# EAGLE design MAX3378 Regulado-v10 (EAGLE 6.2)
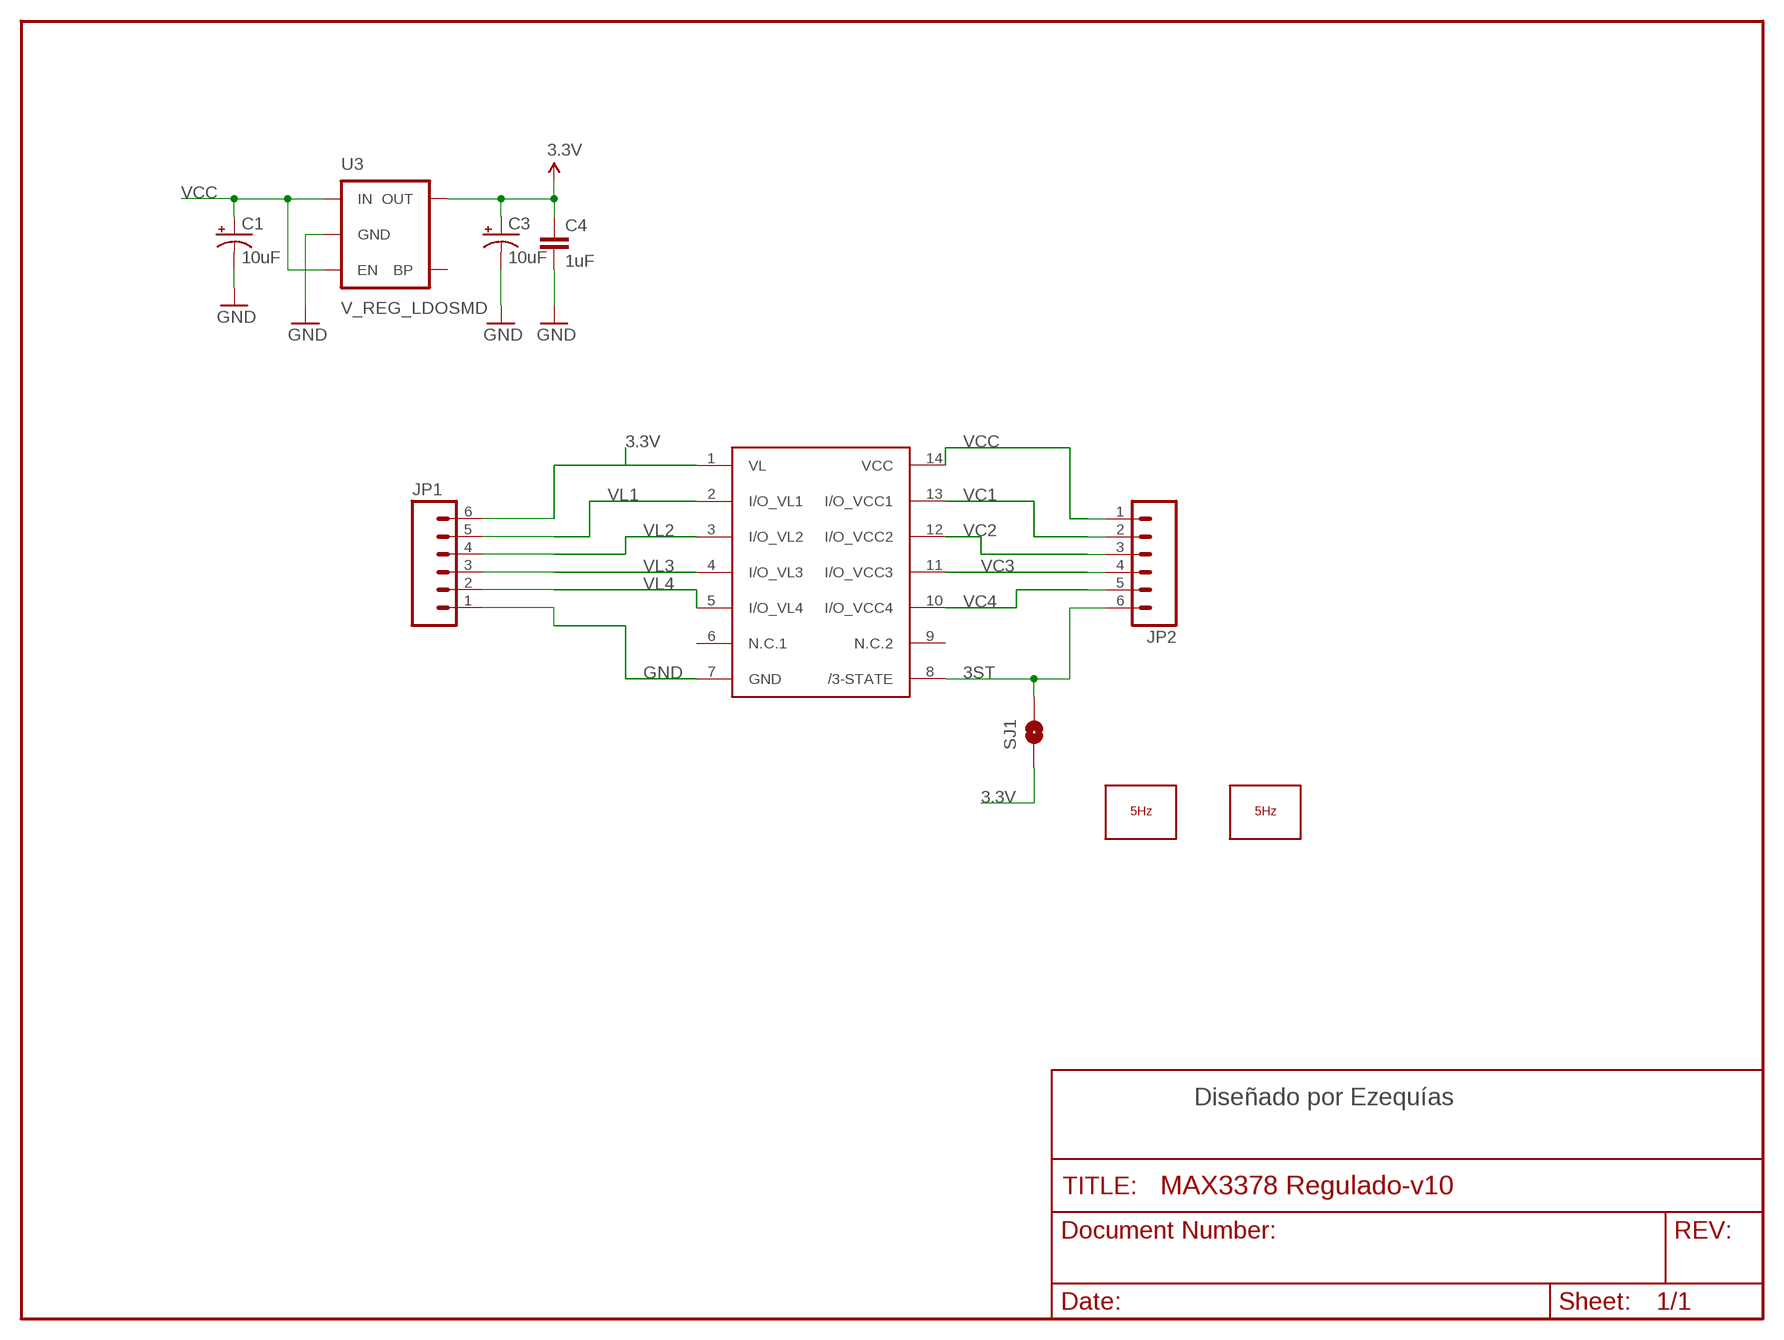
[diagram p0: schematic, sheet 1]

## Parts
C1  10uF  CAP_POL1206  [EIA3216]
C3  10uF  CAP_POL1206  [EIA3216]
C4  1uF  CAP0603-CAP  [0603-CAP]
JP1  M06SIP  [1X06]
JP2  M06SIP  [1X06]
LOGO1  LOGO_5HZ_H_COOPER_15MM  [5HZ_LOGO_H_COOPER_15MM]
LOGO2  LOGO_5HZ_WEB_10MM  [5HZ_WEB_10MM]
SJ1  SOLDERJUMPERNO  [SJ_2S-NO]
U3  V_REG_LDOSMD  [SOT23-5]
U$1  MAX3378  [TSSOP14]

## Nets
3.3V: C3.A(+) C4.1 JP1.6 SJ1.1 U3.5(OUT) U$1.1(VL)
3ST: JP2.6 SJ1.2 U$1.8(/3-STATE)
GND: C1.C(-) C3.C(-) C4.2 JP1.1 U3.2(GND) U$1.7(GND)
VC1: JP2.2 U$1.13(I/O_VCC1)
VC2: JP2.3 U$1.12(I/O_VCC2)
VC3: JP2.4 U$1.11(I/O_VCC3)
VC4: JP2.5 U$1.10(I/O_VCC4)
VCC: C1.A(+) JP2.1 U3.1(IN) U3.3(EN) U$1.14(VCC)
VL1: JP1.5 U$1.2(I/O_VL1)
VL2: JP1.4 U$1.3(I/O_VL2)
VL3: JP1.3 U$1.4(I/O_VL3)
VL4: JP1.2 U$1.5(I/O_VL4)
Unconnected: U3.4(BP) U$1.6(N.C.1) U$1.9(N.C.2)

## Notes on the sheet
- Diseñado por Ezequías

## Library data of the parts
C1 C3 = SparkFun:CAP_POL: Capacitor Polarized These are standard SMD and PTH capacitors. Normally 10uF, 47uF, and 100uF in electrolytic and tantalum varieties. Always verify the external diameter of the through hole cap, it varies with capacity, voltage, and manufacturer. The EIA devices should be standard.
C4 = SparkFun:CAP: Capacitor Standard 0603 ceramic capacitor, and 0.1" leaded capacitor.
JP1 JP2 = SparkFun:M06: Header 6 Standard 6-pin 0.1" header. Use with straight break away headers (SKU : PRT-00116), right angle break away headers (PRT-00553), swiss pins (PRT-00743), machine pins (PRT-00117), and female headers (PRT-00115). Molex polarized connector foot print use with SKU : PRT-08094 with associated crimp pins and housings. NOTES ON THE VARIANTS LOCK and LOCK_LONGPADS... This footprint was designed to help hold the alignment of a through-hole component (i.e. 6-pin header) while soldering it into place. You may notice that each hole has been shifted either up or down by 0.005 of an inch from it's more standard position (which is a perfectly straight line). This slight alteration caused the pins (the squares in the middle) to touch the edges of the holes. Because they are alternating, it causes a "brace" to hold the component in place. 0.005 has proven to be the perfect amount of "off-center" position when using our standard breakaway headers. Although looks a little odd when you look at the bare footprint, once you have a header in there, the alteration is very hard to notice. Also, if you push a header all the way into place, it is covered up entirely on the bottom side. This idea of altering the position of holes to aid alignment will be further integrated into the Sparkfun Library for other footprints. It can help hold any component with 3 or more connection pins.
LOGO1 LOGO2 = 5hz-electronica:LOGO_5HZ: Logotipo 5Hz "según Pedro"
SJ1 = SparkFun:SOLDERJUMPER: Solder Jumper Standard SMD solder jumper. Used to automate production. Two varients : Normally Open and Normally Closed are the same, but have different paste layers. NC will have a large amount of paste and should jumper during reflow.
U3 = SparkFun:V_REG_LDO: Voltage Regulator LDO Standard 150mA LDO voltage regulator in SOT-23 layout. Micrel part MIC5205. BP (by-pass) pin is used to lower output noise with 470pF cap.
U$1 = MAÑE:MAX3378

## Board
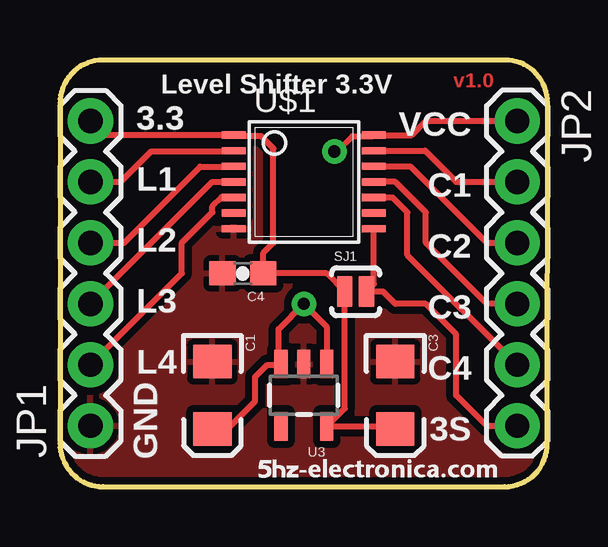
[diagram p1: board, top side]
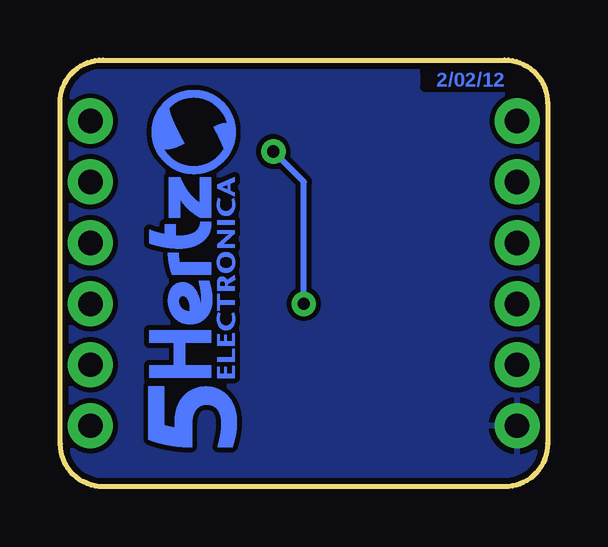
[diagram p2: board, bottom side, seen from below]

Size 20.32 x 17.78 mm. Coordinates in mm from the lower left corner, seen from the top.
Outline: 20.32,16 arc91 18.52,17.78 1.8,17.78 arc90 0,15.98 0,1.8 arc90 1.8,0 18.52,0 arc90 20.3,1.78 20.32,16
Copper layers (1*16): Top 0.035mm / dielectric 1.5mm / Bottom 0.035mm
Design rules: minimum track width 8mil, minimum drill 20mil, track to track 8mil, track to pad 8mil, pad to pad 8mil, via to via 8mil, smd to smd 8mil, copper to edge 10mil, drill to drill 8mil, minimum pad ring 12mil, minimum via ring 10mil, stop-mask expansion 4mil, vias tented up to drill 25mil, thermal gap 10mil

### Footprints (pad centres in the part's own frame; a part is rotated, then mirrored left to right if it is on the bottom)
EIA3216 = smd 1.4 x 1.6: A 1.4,0; C -1.4,0
0603-CAP = smd 1.1 x 1: 1 -0.85,0; 2 0.85,0
1X06 = drill 1.016 pad 1.88: 1 0,0; 2 2.54,0; 3 5.08,0; 4 7.62,0; 5 10.16,0; 6 12.7,0
SJ_2S-NO = smd 0.635 x 1.27: 1 -0.45,0; 2 0.45,0
SOT23-5 = smd 0.55 x 1.2: 1 -0.95,-1.3; 2 0,-1.3; 3 0.95,-1.3; 4 0.95,1.3; 5 -0.95,1.3
TSSOP14 = smd 0.305 x 0.991: 1 -1.95,-2.918; 2 -1.3,-2.918; 3 -0.65,-2.918; 4 0,-2.918; 5 0.65,-2.918; 6 1.3,-2.918; 7 1.95,-2.918; 8 1.95,2.918; 9 1.3,2.918; 10 0.65,2.918; 11 0,2.918; 12 -0.65,2.918; 13 -1.3,2.918; 14 -1.95,2.918

### Placement (x,y rotation side)
C1  6.35,3.81 270 top
C3  13.97,3.81 270 top
C4  7.62,8.89 180 top
JP1  1.27,2.54 90 top
JP2  19.05,15.24 270 top
LOGO1  12.95,1.65 90 bottom
LOGO2  8.26,0.38 0 top
SJ1  12.32,8.13 0 top
U3  10.16,3.81 180 top
U$1  10.16,12.7 270 top

### Tracks (layer width: path | path; a pad name or v marks a point on that pad's centre or on a via)
3.3V
  Top 0.254: C3.A 13.87,2.51 U3.5 11.87,3.27 SJ1.1 11.11,8.89 C4.1 8.47,9.74 8.89,10.16 8.89,14.1 8.38,14.61 7.29,14.61 U$1.1 1.86,14.65 JP1.6
3ST
  Top 0.254: U$1.8 13.08,8.44 SJ1.2 13.46,8.13 13.97,7.62 15.24,7.62 16.51,6.35 16.51,3.81 17.78,2.54 JP2.6
GND
  pour Bottom: 20.32,17.78 1.8,17.78 arc90 0,15.98 0,1.8 arc90 1.8,0 18.52,0 arc90 20.32,1.8
  pour Top (isolate 0.305): 20.32,15.98 arc90 18.52,17.78 1.8,17.78 arc90 0,15.98 0,1.8 arc90 1.8,0 18.52,0 arc90 20.32,1.8
  pour Bottom (isolate 0.305): 20.32,15.98 arc90 18.52,17.78 1.8,17.78 arc90 0,15.98 0,1.8 arc90 1.8,0 18.52,0 arc90 20.32,1.8
VC1
  Top 0.254: U$1.13 15.21,14 16.51,12.7 JP2.2
VC2
  Top 0.254: U$1.12 14.59,13.35 17.78,10.16 JP2.3
VC3
  Top 0.254: JP2.4 17.78,7.62 15.24,10.16 15.24,11.43 13.97,12.7 U$1.11
VC4
  Top 0.254: U$1.10 13.86,12.05 14.48,11.43 14.48,9.65 JP2.5
VCC  (via drill 0.51)
  Top 0.254: 11.11,5.4 U3.1 11.11,6.67 v10.16,7.62 9.11,6.57 9.11,5.21 U3.3 9.18,5.08 8.64,5.08 8.13,4.57 8.13,3.56 6.98,2.41 C1.A | v11.43,13.97 11.56,13.97 12.19,14.61 13.03,14.61 U$1.14 14.65,14.65 15.24,15.24 JP2.1
  Bottom 0.254: v10.16,7.62 10.16,12.7 v11.43,13.97
VL1
  Top 0.254: JP1.5 2.54,12.7 3.81,13.97 7.21,13.97 U$1.2
VL2
  Top 0.254: JP1.4 2.67,10.16 5.84,13.34 7.23,13.34 U$1.3
VL3
  Top 0.254: JP1.3 6.35,12.7 U$1.4
VL4
  Top 0.254: JP1.2 5.08,8.89 5.08,10.16 6.35,11.43 6.35,11.68 6.73,12.06 7.23,12.06 U$1.5

### Text on the board
Top: v1.0
Bottom: 2/02/12
tPlace: Level Shifter 3.3V | VCC | 3.3 | C1 | L1 | C2 | L2 | C3 | L3 | L4 | C4 | 3S | GND